# Altium schematic sheet Communication.SchDoc
size A4
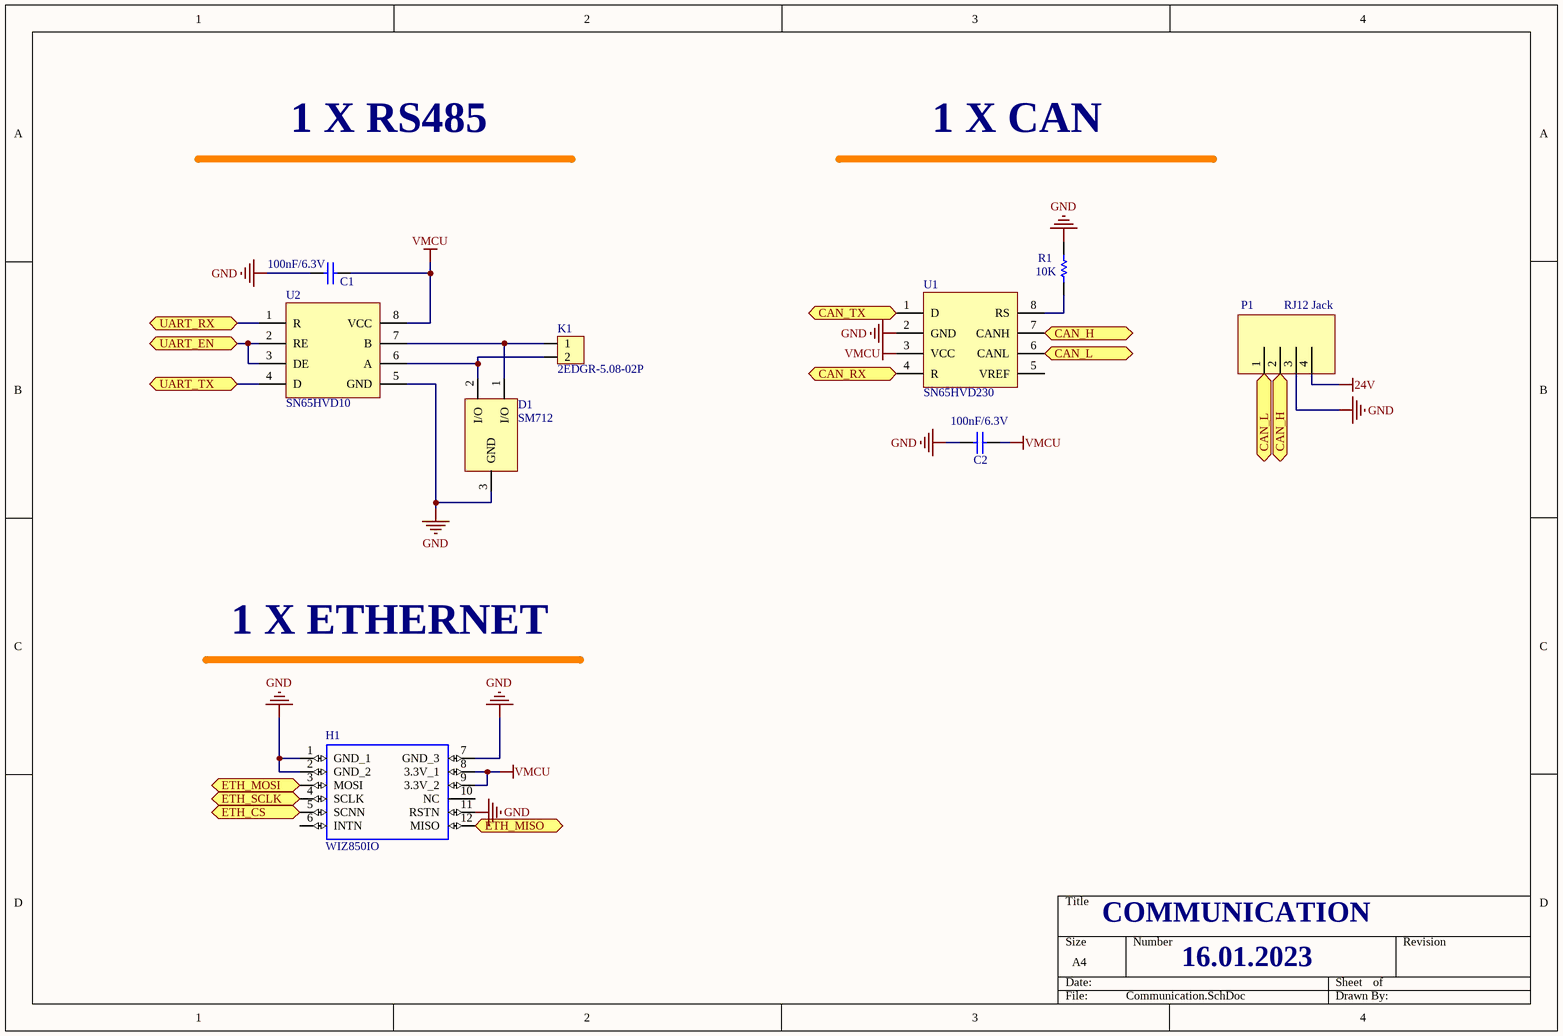
[diagram p0: Communication.SchDoc]

## Parts
C1  100nF/6.3V  [CAP0603W]
C2  100nF/6.3V  [CAP0603W]
D1  SM712  [SOT23 - BC8X6]
H1  WIZ850IO  [WIZ850IO]
K1  2EDGR-5.08-02P  [CON_DG129_02P]
P1  RJ12 Jack  [rj12_90deg_con_4p4c]
R1  10K  [RES1608[0603]]
U1  SN65HVD230  [SO8]
U2  SN65HVD10  [SO8]

## Ports
CAN_H, CAN_L, CAN_RX, CAN_TX, ETH_CS, ETH_MISO, ETH_MOSI, ETH_SCLK, UART_EN, UART_RX, UART_TX

## Nets
24V: P1.4
GND: C1.1 C2.1 D1.3(GND) H1.1(GND_1) H1.2(GND_2) H1.7(GND_3) H1.11(RSTN) P1.3 R1.1 U1.2(GND) U2.5(GND)
VMCU: C1.2 C2.2 H1.8(3.3V_1) H1.9(3.3V_2) U1.3(VCC) U2.8(VCC)
CAN_H: P1.2 U1.7(CANH) ; port CAN_H
CAN_L: P1.1 U1.6(CANL) ; port CAN_L
CAN_RX: U1.4(R) ; port CAN_RX
CAN_TX: U1.1(D) ; port CAN_TX
ETH_CS: H1.5(SCNN) ; port ETH_CS
ETH_MISO: H1.12(MISO) ; port ETH_MISO
ETH_MOSI: H1.3(MOSI) ; port ETH_MOSI
ETH_SCLK: H1.4(SCLK) ; port ETH_SCLK
UART_EN: U2.2(RE) U2.3(DE) ; port UART_EN
UART_RX: U2.1(R) ; port UART_RX
UART_TX: U2.4(D) ; port UART_TX
NetD1_1: D1.1(I/O) K1.1 U2.7(B)
NetD1_2: D1.2(I/O) K1.2 U2.6(A)
NetR1_2: R1.2 U1.8(RS)

Not connected (* = marked no-connect by the designer): H1 6(INTN) 10(NC); U1 5(VREF)

## Notes on the sheet
- 1 X RS485
- 1 X CAN
- 1 X ETHERNET
- COMMUNICATION
- 16.01.2023

## Library data of the parts
C1 C2 = CAP1: CAPACITOR 0603 Case; Value: 100nF; Published: 8-Jun-2000; LatestRevisionDate: 17-Jul-2002; LatestRevisionNote: Re-released for DXP Platform.; PackageReference: C1206; Publisher: Altium Limited
D1 = SM712: DIODE TVS Array For Rs485
H1 = WIZ850IO: Ethernet - 10/100 Base-T/TX PHY SPI Interface Module; MF: WIZnet; Value: *; Package: Module WIZnet; Availability: In Stock; Check_prices: https://www.snapeda.com/parts/WIZ850IO/WIZnet/view-part/?ref=eda; SnapEDA_Link: https://www.snapeda.com/parts/WIZ850IO/WIZnet/view-part/?ref=snap; Purchase-URL: https://pricing.snapeda.com/search/part/WIZ850IO/?ref=eda; MP: WIZ850IO; Price: None
K1 = KLEMENS_2P: CONNECTOR 5.08mm 2PIN 90DEG
P1 = RJ12_4P4C: CONNECTOR RJ12 Jack, 90 Degree
R1 = RES: RESISTOR 0603 Case %1; Value: 430R; Published: 8-Jun-2000; LatestRevisionDate: 17-Jul-2002; LatestRevisionNote: Re-released for DXP Platform.; PackageReference: AXIAL-0.5; Publisher: Altium Limited
U1 = SN65HVD230: CAN Interface IC 3.3V CAN Transceiver; Published: 24-Aug-2001; LatestRevisionDate: 6-Jun-2005; LatestRevisionNote: Stylized 3D Model Added.; DatasheetDocument: Feb-1998; PackageDocument: Aug-1999; PackageReference: SO8W; Publisher: Altium Limited; ComponentLink1Description: Manufacturer Link; ComponentLink1URL: http://www.st.com/
U2 = 75176: IC SN65HVD10DR SMD SOIC8; Published: 24-Aug-2001; LatestRevisionDate: 6-Jun-2005; LatestRevisionNote: Stylized 3D Model Added.; DatasheetDocument: Feb-1998; PackageDocument: Aug-1999; PackageReference: SO8W; Publisher: Altium Limited; ComponentLink1Description: Manufacturer Link; ComponentLink1URL: http://www.st.com/